# Altium schematic sheet VME_buffers_address.SchDoc: VME buffers
size 420 x 297 mm; CheckedBy: T.Janicki; CompanyName: Creotech Instruments SA; DrawnBy: G.Kasprowicz; Organization: CERN; Address1: European Organization for Nuclear Research; Address2: CH-1211 Geneve 23 - Switzerland; Revision: -; SheetNumber: 20; SheetTotal: 21; EDA_Number: EDA-xxxx; Projet: Simple VME FMC Carrier; ModifiedBy: -; CreateDate: 30/04/2012; CheckedDate: 30/04/2012; Title2: - address part -; DivGrp: BE-CO; Designer: G.Kasprowicz; PageSetup: Record=PageOptions|CenterHorizontal=True|CenterVertical=True|PrintScale=0.95|XCorrection=1.00|YCorrection=1.00|PrintKind=1|BorderSize=5000000|LeftOffset=0|BottomOffset=0|Orientation=2|PaperLength=1000|PaperWidth=1000|Scale=100|PaperSource=15|PrintQuality=600|MediaType=1|DitherType=10|PaperKind=A3|PrintScaleMode=1; ModifiedDate: -
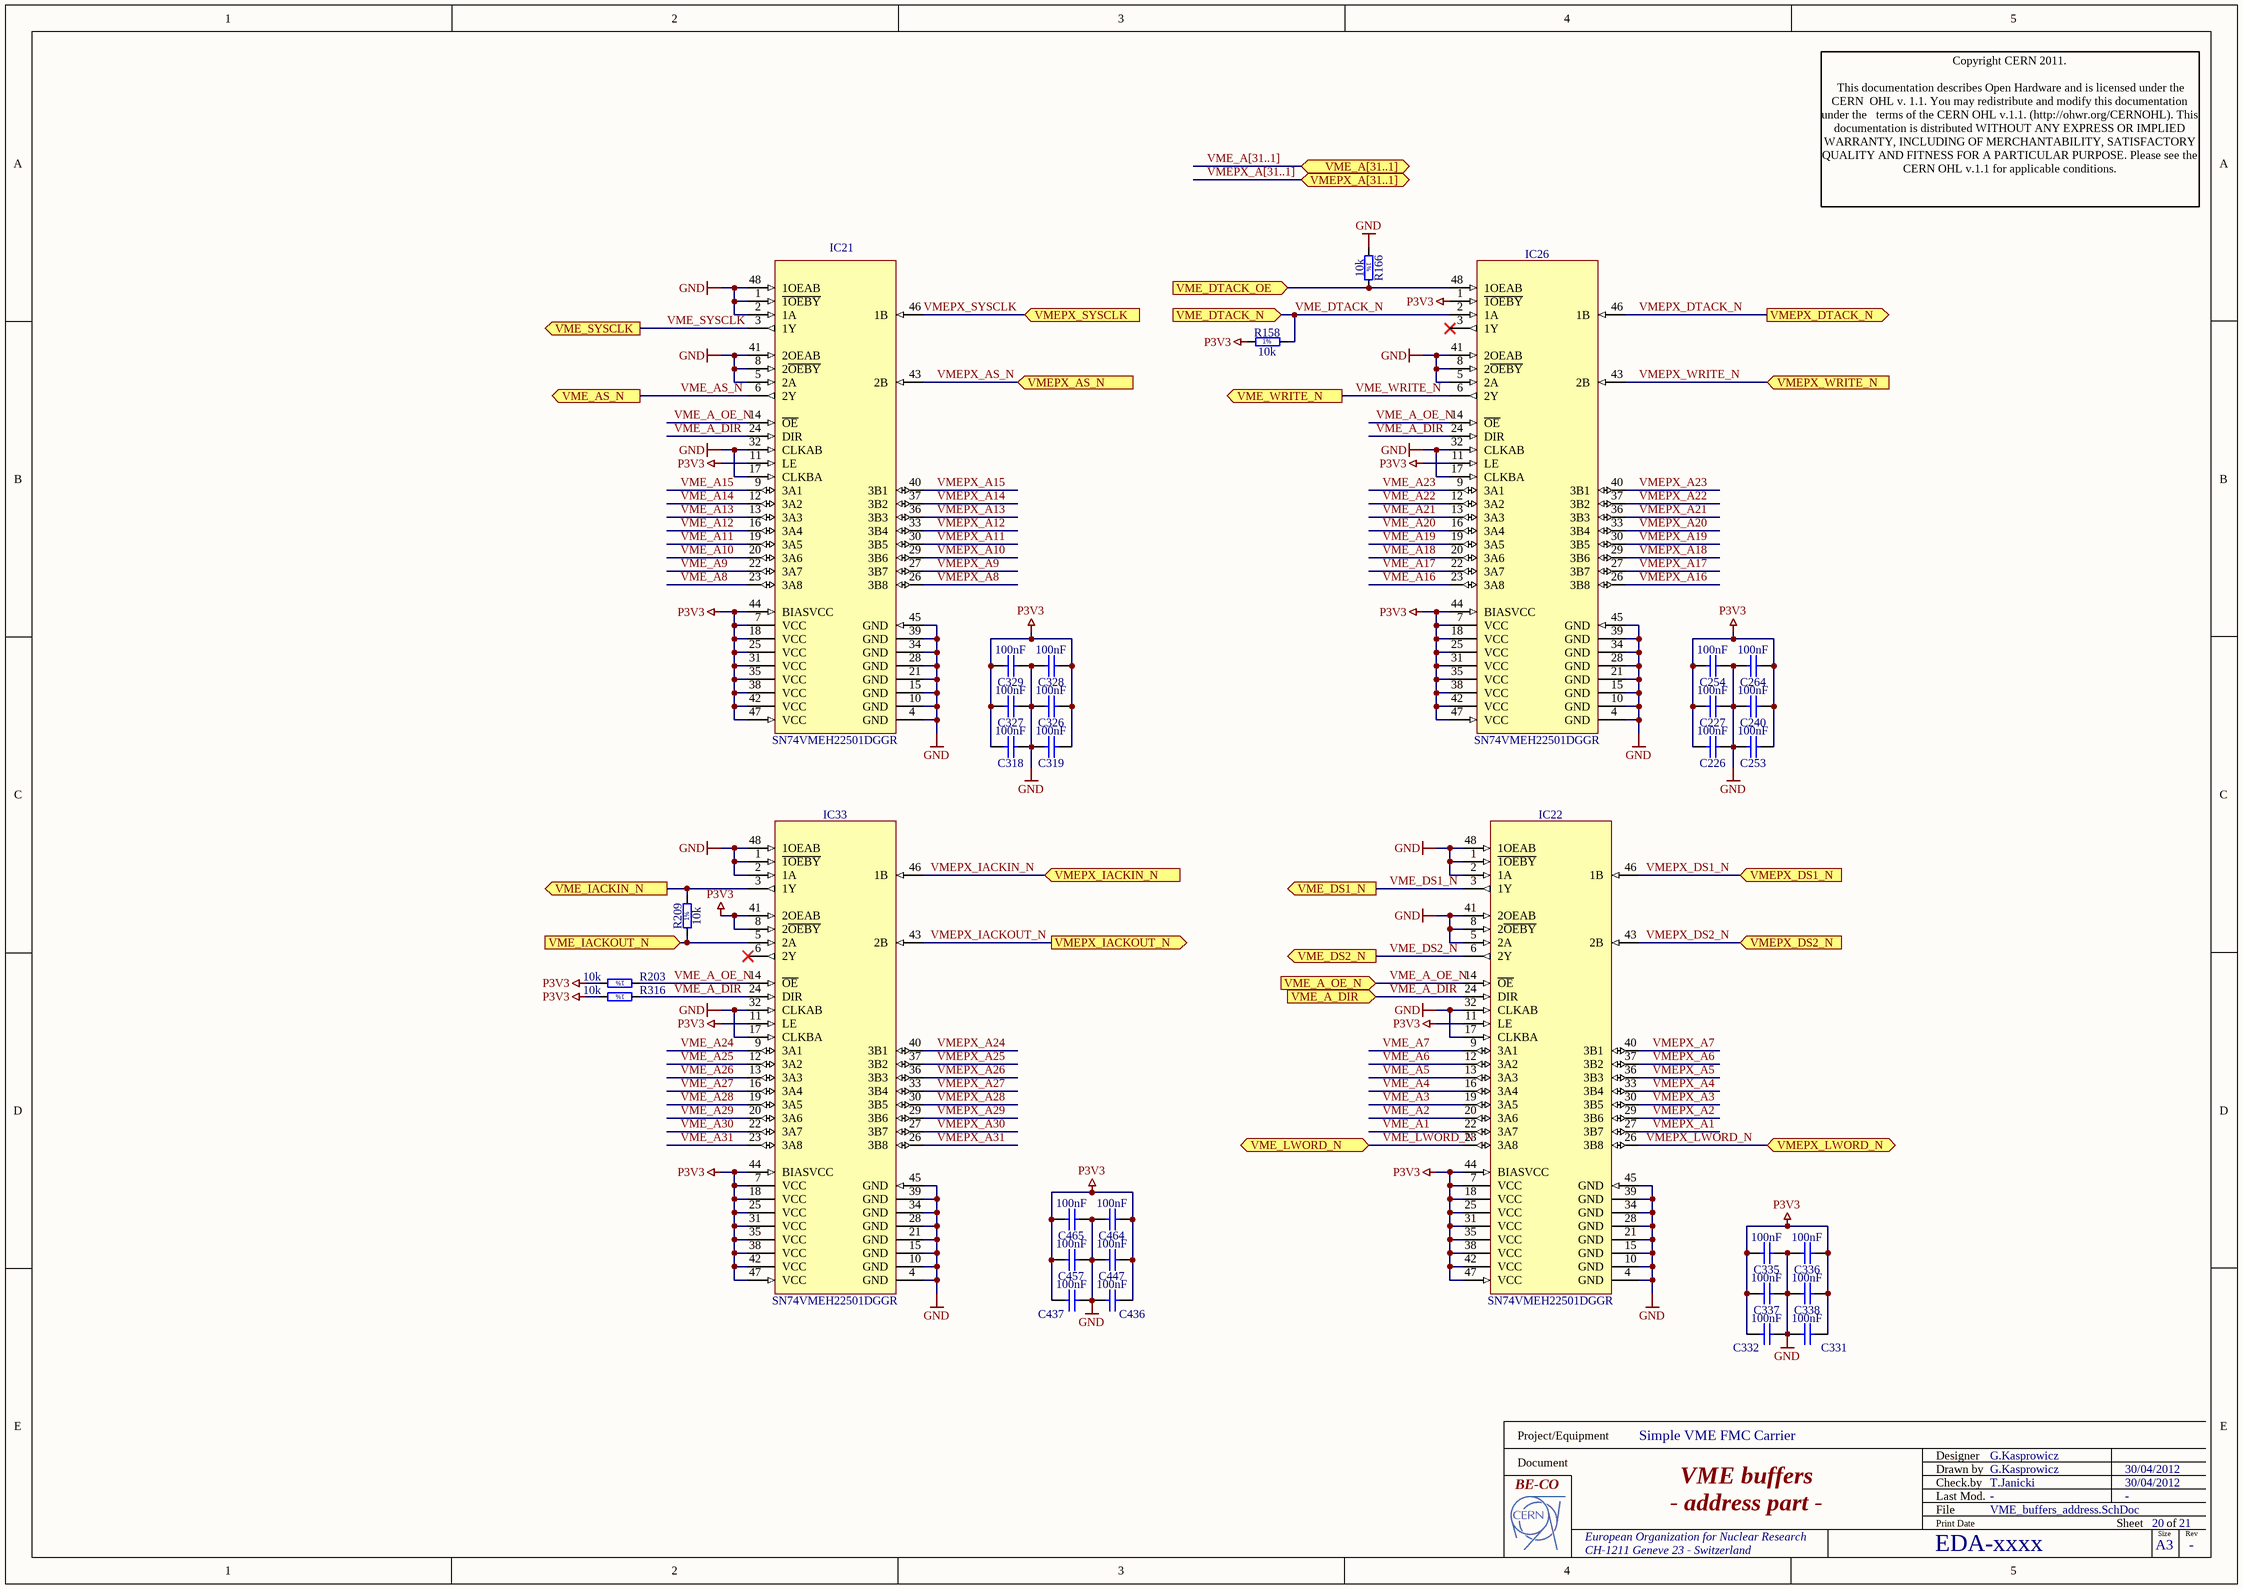
[diagram p0: VME_buffers_address.SchDoc]

## Parts
C226  100nF  [CAPC1005X55N]
C227  100nF  [CAPC1005X55N]
C240  100nF  [CAPC1005X55N]
C253  100nF  [CAPC1005X55N]
C254  100nF  [CAPC1005X55N]
C264  100nF  [CAPC1005X55N]
C318  100nF  [CAPC1005X55N]
C319  100nF  [CAPC1005X55N]
C326  100nF  [CAPC1005X55N]
C327  100nF  [CAPC1005X55N]
C328  100nF  [CAPC1005X55N]
C329  100nF  [CAPC1005X55N]
C331  100nF  [CAPC1005X55N]
C332  100nF  [CAPC1005X55N]
C335  100nF  [CAPC1005X55N]
C336  100nF  [CAPC1005X55N]
C337  100nF  [CAPC1005X55N]
C338  100nF  [CAPC1005X55N]
C436  100nF  [CAPC1005X55N]
C437  100nF  [CAPC1005X55N]
C447  100nF  [CAPC1005X55N]
C457  100nF  [CAPC1005X55N]
C464  100nF  [CAPC1005X55N]
C465  100nF  [CAPC1005X55N]
IC21  SN74VMEH22501DGGR  [SOP50P810X120-48N]
IC22  SN74VMEH22501DGGR  [SOP50P810X120-48N]
IC26  SN74VMEH22501DGGR  [SOP50P810X120-48N]
IC33  SN74VMEH22501DGGR  [SOP50P810X120-48N]
R158  10k  [RESC1608X55N]
R166  10k  [RESC1608X55N]
R203  10k  [RESC1608X55N]
R209  10k  [RESC1608X55N]
R316  10k  [RESC1608X55N]

## Ports
VME_A[31..1] (bidir), VME_A_DIR (in), VME_A_OE_N (in), VME_AS_N (out), VME_DS1_N (out), VME_DS2_N (out), VME_DTACK_N (in), VME_DTACK_OE (in), VME_IACKIN_N (out), VME_IACKOUT_N (in), VME_LWORD_N (bidir), VME_SYSCLK (out), VME_WRITE_N (out), VMEPX_A[31..1] (bidir), VMEPX_AS_N (in), VMEPX_DS1_N (in), VMEPX_DS2_N (in), VMEPX_DTACK_N (out), VMEPX_IACKIN_N (in), VMEPX_IACKOUT_N (out), VMEPX_LWORD_N (bidir), VMEPX_SYSCLK (in), VMEPX_WRITE_N (in)

## Nets
GND: C226.1 C227.1 C240.2 C253.2 C254.1 C264.2 C318.1 C319.2 C326.2 C327.1 C328.2 C329.1 C331.2 C332.1 C335.1 C336.2 C337.1 C338.2 C436.2 C437.1 C447.2 C457.1 C464.2 C465.1 IC21.1(~{1OEBY}) IC21.2(1A) IC21.4(GND) IC21.5(2A) IC21.8(2~{OEBY}) IC21.10(GND) IC21.15(GND) IC21.17(CLKBA) IC21.21(GND) IC21.28(GND) IC21.32(CLKAB) IC21.34(GND) IC21.39(GND) IC21.41(2OEAB) IC21.45(GND) IC21.48(1OEAB) IC22.1(~{1OEBY}) IC22.2(1A) IC22.4(GND) IC22.5(2A) IC22.8(2~{OEBY}) IC22.10(GND) IC22.15(GND) IC22.17(CLKBA) IC22.21(GND) IC22.28(GND) IC22.32(CLKAB) IC22.34(GND) IC22.39(GND) IC22.41(2OEAB) IC22.45(GND) IC22.48(1OEAB) IC26.4(GND) IC26.5(2A) IC26.8(2~{OEBY}) IC26.10(GND) IC26.15(GND) IC26.17(CLKBA) IC26.21(GND) IC26.28(GND) IC26.32(CLKAB) IC26.34(GND) IC26.39(GND) IC26.41(2OEAB) IC26.45(GND) IC33.1(~{1OEBY}) IC33.2(1A) IC33.4(GND) IC33.10(GND) IC33.15(GND) IC33.17(CLKBA) IC33.21(GND) IC33.28(GND) IC33.32(CLKAB) IC33.34(GND) IC33.39(GND) IC33.45(GND) IC33.48(1OEAB) R166.1
P3V3: C226.2 C227.2 C240.1 C253.1 C254.2 C264.1 C318.2 C319.1 C326.1 C327.2 C328.1 C329.2 C331.1 C332.2 C335.2 C336.1 C337.2 C338.1 C436.1 C437.2 C447.1 C457.2 C464.1 C465.2 IC21.7(VCC) IC21.11(LE) IC21.18(VCC) IC21.25(VCC) IC21.31(VCC) IC21.35(VCC) IC21.38(VCC) IC21.42(VCC) IC21.44(BIASVCC) IC21.47(VCC) IC22.7(VCC) IC22.11(LE) IC22.18(VCC) IC22.25(VCC) IC22.31(VCC) IC22.35(VCC) IC22.38(VCC) IC22.42(VCC) IC22.44(BIASVCC) IC22.47(VCC) IC26.1(~{1OEBY}) IC26.7(VCC) IC26.11(LE) IC26.18(VCC) IC26.25(VCC) IC26.31(VCC) IC26.35(VCC) IC26.38(VCC) IC26.42(VCC) IC26.44(BIASVCC) IC26.47(VCC) IC33.7(VCC) IC33.8(2~{OEBY}) IC33.11(LE) IC33.18(VCC) IC33.25(VCC) IC33.31(VCC) IC33.35(VCC) IC33.38(VCC) IC33.41(2OEAB) IC33.42(VCC) IC33.44(BIASVCC) IC33.47(VCC) R158.1 R203.2 R316.2
VME_A1: IC22.22(3A7)
VME_A2: IC22.20(3A6)
VME_A3: IC22.19(3A5)
VME_A4: IC22.16(3A4)
VME_A5: IC22.13(3A3)
VME_A6: IC22.12(3A2)
VME_A7: IC22.9(3A1)
VME_A8: IC21.23(3A8)
VME_A9: IC21.22(3A7)
VME_A10: IC21.20(3A6)
VME_A11: IC21.19(3A5)
VME_A12: IC21.16(3A4)
VME_A13: IC21.13(3A3)
VME_A14: IC21.12(3A2)
VME_A15: IC21.9(3A1)
VME_A16: IC26.23(3A8)
VME_A17: IC26.22(3A7)
VME_A18: IC26.20(3A6)
VME_A19: IC26.19(3A5)
VME_A20: IC26.16(3A4)
VME_A21: IC26.13(3A3)
VME_A22: IC26.12(3A2)
VME_A23: IC26.9(3A1)
VME_A24: IC33.9(3A1)
VME_A25: IC33.12(3A2)
VME_A26: IC33.13(3A3)
VME_A27: IC33.16(3A4)
VME_A28: IC33.19(3A5)
VME_A29: IC33.20(3A6)
VME_A30: IC33.22(3A7)
VME_A31: IC33.23(3A8)
VME_A_DIR: IC21.24(DIR) IC22.24(DIR) IC26.24(DIR) IC33.24(DIR) R316.1 ; port VME_A_DIR
VME_A_OE_N: IC21.14(~{OE}) IC22.14(~{OE}) IC26.14(~{OE}) IC33.14(~{OE}) R203.1 ; port VME_A_OE_N
VME_AS_N: IC21.6(2Y) ; port VME_AS_N
VME_DS1_N: IC22.3(1Y) ; port VME_DS1_N
VME_DS2_N: IC22.6(2Y) ; port VME_DS2_N
VME_DTACK_N: IC26.2(1A) R158.2 ; port VME_DTACK_N
VME_DTACK_OE: IC26.48(1OEAB) R166.2 ; port VME_DTACK_OE
VME_IACKIN_N: IC33.3(1Y) R209.2 ; port VME_IACKIN_N
VME_IACKOUT_N: IC33.5(2A) R209.1 ; port VME_IACKOUT_N
VME_LWORD_N: IC22.23(3A8) ; port VME_LWORD_N
VME_SYSCLK: IC21.3(1Y) ; port VME_SYSCLK
VME_WRITE_N: IC26.6(2Y) ; port VME_WRITE_N
VMEPX_A1: IC22.27(3B7)
VMEPX_A2: IC22.29(3B6)
VMEPX_A3: IC22.30(3B5)
VMEPX_A4: IC22.33(3B4)
VMEPX_A5: IC22.36(3B3)
VMEPX_A6: IC22.37(3B2)
VMEPX_A7: IC22.40(3B1)
VMEPX_A8: IC21.26(3B8)
VMEPX_A9: IC21.27(3B7)
VMEPX_A10: IC21.29(3B6)
VMEPX_A11: IC21.30(3B5)
VMEPX_A12: IC21.33(3B4)
VMEPX_A13: IC21.36(3B3)
VMEPX_A14: IC21.37(3B2)
VMEPX_A15: IC21.40(3B1)
VMEPX_A16: IC26.26(3B8)
VMEPX_A17: IC26.27(3B7)
VMEPX_A18: IC26.29(3B6)
VMEPX_A19: IC26.30(3B5)
VMEPX_A20: IC26.33(3B4)
VMEPX_A21: IC26.36(3B3)
VMEPX_A22: IC26.37(3B2)
VMEPX_A23: IC26.40(3B1)
VMEPX_A24: IC33.40(3B1)
VMEPX_A25: IC33.37(3B2)
VMEPX_A26: IC33.36(3B3)
VMEPX_A27: IC33.33(3B4)
VMEPX_A28: IC33.30(3B5)
VMEPX_A29: IC33.29(3B6)
VMEPX_A30: IC33.27(3B7)
VMEPX_A31: IC33.26(3B8)
VMEPX_AS_N: IC21.43(2B) ; port VMEPX_AS_N
VMEPX_DS1_N: IC22.46(1B) ; port VMEPX_DS1_N
VMEPX_DS2_N: IC22.43(2B) ; port VMEPX_DS2_N
VMEPX_DTACK_N: IC26.46(1B) ; port VMEPX_DTACK_N
VMEPX_IACKIN_N: IC33.46(1B) ; port VMEPX_IACKIN_N
VMEPX_IACKOUT_N: IC33.43(2B) ; port VMEPX_IACKOUT_N
VMEPX_LWORD_N: IC22.26(3B8) ; port VMEPX_LWORD_N
VMEPX_SYSCLK: IC21.46(1B) ; port VMEPX_SYSCLK
VMEPX_WRITE_N: IC26.43(2B) ; port VMEPX_WRITE_N

Not connected (* = marked no-connect by the designer): IC26 3(1Y)*; IC33 6(2Y)*

## Buses and harness runs
bus VME_A[31..1] = port VME_A[31..1]
bus VMEPX_A[31..1] = port VMEPX_A[31..1]

## Notes on the sheet
- Copyright CERN 2011.
  This documentation describes Open Hardware and is licensed under the CERN  OHL v. 1.1. You may redistribute and modify this documentation under the   terms of the CERN OHL v.1.1. (http://ohwr.org/CERNOHL). This  documentation is distributed WITHOUT ANY EXPRESS OR IMPLIED  WARRANTY, INCLUDING OF MERCHANTABILITY, SATISFACTORY  QUALITY AND FITNESS FOR A PARTICULAR PURPOSE. Please see the  CERN OHL v.1.1 for applicable conditions.
- Project/Equipment
- Document
- Designer
- Drawn by
- Check.by
- File
- Last Mod.
- Print Date
- Sheet
- Size
- A3
- of
- Rev
- (in symbol R0603_10K_1%_0.1W_100PPM) 1%

## Library data of the parts
C226 C227 C240 C253 C254 C264 C318 C319 C326-C329 C331 C332 C335-C338 C436 C437 C447 C457 C464 C465 = CC0402_100NF_16V_10%_X7R: Non-polarised capacitor; Part Description: SMD Multilayer Chip Ceramic Capacitor; Manufacturer: GENERIC; Manufacturer1 Part Number: 223878715649; Voltage: 16V; TC: X7R; Tolerance: ±10%; Table: Capacitors SMD; Part Number: CC0402_100NF_16V_10%_X7R; Component Kind: Standard; Component Type: Standard; Pin Count: 2; Value: 100nF; Status: Not Recommended; Manufacturer Part Number: CC0402_100NF_16V_10%_X7R; Case: 0402; Mounted: Yes; Socket: No; SMD: Yes; Manufacturer1 Example: PHYCOMP; Manufacturer1 ComponentHeight: 0.55mm; HelpURL: \\cern.ch\dfs\Applications\Altium\Datasheets\CC0402_X7R_PHYCOMP.pdf; Author: CERN DEM JLC; CreateDate: 12/3/2007; LatestRevisionDate: 12/3/2007
IC21 IC22 IC26 IC33 = SN74VMEH22501DGGR: 8-Bit Universal Bus Transceiver and Two 1-Bit Bus Transceivers with 3-State Outputs; Manufacturer: TEXAS INSTRUMENTS; Table: Standard Logic; Part Number: SN74VMEH22501DGGR; Component Kind: Standard; Component Type: Standard; Device: SN74VMEH22501DGGR; PackageDescription: SOP, 48-Leads, Body 12.6x6.2mm (max), Pitch 0.50mm, IPC Medium Density; Part Description: 8-Bit Universal Bus Transceiver and Two 1-Bit Bus Transceivers with 3-State Outputs; Manufacturer Part Number: SN74VMEH22501DGGR; Pin Count: 48; Case: TSSOP48; Mounted: Yes; Socket: No; SMD: Yes; ComponentHeight: 1.2mm; Author: CERN DEM JLC; HelpURL: \\cern.ch\dfs\Applications\Altium\Datasheets\SN74VMEH22501DGGR.pdf; CreateDate: 10/27/2009; LatestRevisionDate: 10/27/2009
R158 R166 R203 R209 R316 = R0603_10K_1%_0.1W_100PPM: Resistor - 1%; Part Description: General Purpose Thick Film Chip Resistor; Manufacturer: GENERIC; Manufacturer1 Part Number: NRC06F1002TRF; Power: 0.1W; TC: ±100ppm/°C; Table: Resistors SMD; Part Number: R0603_10K_1%_0.1W_100PPM; Component Kind: Standard; Component Type: Standard; Pin Count: 2; Value: 10k; Status: Preferred; Tolerance: ±1%; Manufacturer Part Number: R0603_10K_1%_0.1W_100PPM; Case: 0603; Mounted: Yes; Socket: No; SMD: Yes; Manufacturer1 Example: NIC COMPONENT; Manufacturer1 ComponentHeight: 0.55mm; HelpURL: \\cern.ch\dfs\Applications\Altium\Datasheets\R0603_NIC_NRC.pdf; Author: CERN DEM JLC; CreateDate: 2007-12-03; LatestRevisionDate: 2008-03-13